# EAGLE design ws2801 (EAGLE 5.11)
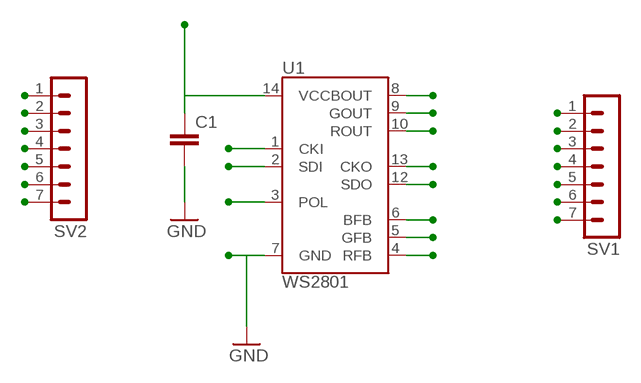
[diagram p0: schematic, sheet 1]

## Parts
C1  CAP1206  [1206]
SV1  MA07-1  [MA07-1]
SV2  MA07-1  [MA07-1]
U1  WS2801  [SOP-14]

## Nets
BFB: SV2.6 U1.6(BFB)
BOUT: SV1.1 U1.8(BOUT)
CKI: SV2.1 U1.1(CKI)
CKO: SV1.6 U1.13(CKO)
GFB: SV2.5 U1.5(GFB)
GND: C1.2 SV2.7 U1.7(GND)
GOUT: SV1.2 U1.9(GOUT)
N$4: SV1.4
POL: SV2.3 U1.3(POL)
RFB: SV2.4 U1.4(RFB)
ROUT: SV1.3 U1.10(ROUT)
SDI: SV2.2 U1.2(SDI)
SDO: SV1.5 U1.12(SDO)
VCC: C1.1 SV1.7 U1.14(VCC)

## Library data of the parts
C1 = SparkFun:CAP: Capacitor Standard 0603 ceramic capacitor, and 0.1" leaded capacitor.
SV1 SV2 = con-lstb:MA07-1: PIN HEADER; OC_FARNELL: unknown; OC_NEWARK: unknown
U1 = SparkFun:WS2801: WS2801 3 Channel Constant Current LED Driver with programmable PWM outputs. Datasheet: http://www.sparkfun.com/datasheets/Components/LED/WS2801.pdf

## Board
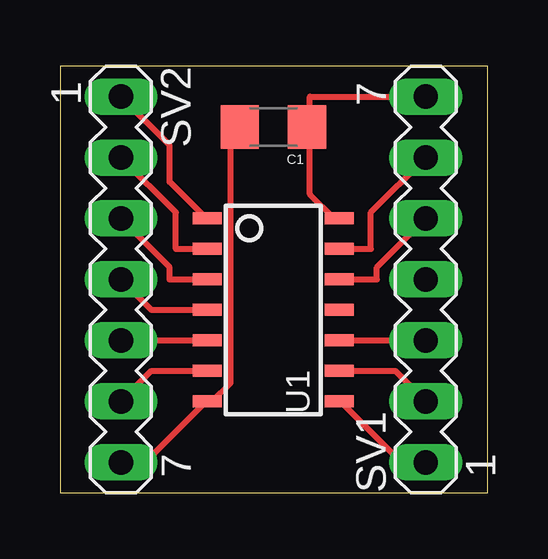
[diagram p1: board, top side]

Size 17.83 x 17.77 mm. Coordinates in mm from the lower left corner, seen from the top.
Outline: 0,0 17.83,0 17.83,17.77 0,17.77 0,0
Copper layers (1*16): Top 0.035mm / dielectric 1.5mm / Bottom 0.035mm
Design rules "default": minimum track width 10mil, minimum drill 24mil, track to track 8mil, track to pad 8mil, pad to pad 8mil, via to via 8mil, smd to smd 8mil, copper to edge 40mil, drill to drill 8mil, minimum pad ring 10mil, minimum via ring 8mil, stop-mask expansion 4mil, vias tented up to drill 0mil, thermal gap 10mil

### Footprints (pad centres in the part's own frame; a part is rotated, then mirrored left to right if it is on the bottom)
1206 = smd 1.6 x 1.8: 1 -1.4,0; 2 1.4,0
MA07-1 = drill 1.016 long: 1 -7.62,0; 2 -5.08,0; 3 -2.54,0; 4 0,0; 5 2.54,0; 6 5.08,0; 7 7.62,0
SOP-14 = smd 0.5 x 1.2: 1 -3.81,-2.75; 2 -2.54,-2.75; 3 -1.27,-2.75; 4 0,-2.75; 5 1.27,-2.75; 6 2.54,-2.75; 7 3.81,-2.75; 8 3.81,2.75; 9 2.54,2.75; 10 1.27,2.75; 11 0,2.75; 12 -1.27,2.75; 13 -2.54,2.75; 14 -3.81,2.75

### Placement (x,y rotation side)
C1  8.89,15.24 180 top
SV1  15.24,8.89 90 top
SV2  2.54,8.89 270 top
U1  8.89,7.62 270 top

### Tracks (layer width: path | path; a pad name or v marks a point on that pad's centre or on a via)
BFB
  Top 0.254: SV2.6 3.81,5.08 U1.6
BOUT
  Top 0.254: SV1.1 14.22,1.27 11.68,3.81 U1.8
CKI
  Top 0.254: SV2.1 4.57,14.48 4.57,12.95 6.1,11.43 U1.1
CKO
  Top 0.254: SV1.6 12.95,11.68 12.95,10.16 U1.13
GFB
  Top 0.254: SV2.5 U1.5
GND
  Top 0.254: SV2.7 3.56,1.27 6.1,3.81 U1.7 6.35,3.81 7.11,4.57 7.11,14.99 7.37,15.24 C1.2
GOUT
  Top 0.254: SV1.2 13.97,5.08 U1.9
POL
  Top 0.254: SV2.3 4.57,9.4 4.57,8.89 U1.3
RFB
  Top 0.254: SV2.4 3.81,7.62 U1.4
ROUT
  Top 0.254: U1.10 SV1.3
SDI
  Top 0.254: SV2.2 4.83,11.68 4.83,10.16 U1.2
SDO
  Top 0.254: SV1.5 13.21,9.4 13.21,8.89 U1.12
VCC
  Top 0.254: 10.41,15.24 10.41,12.45 11.43,11.43 U1.14 | SV1.7 10.41,16.51 10.41,15.24 | 10.41,15.24 C1.1